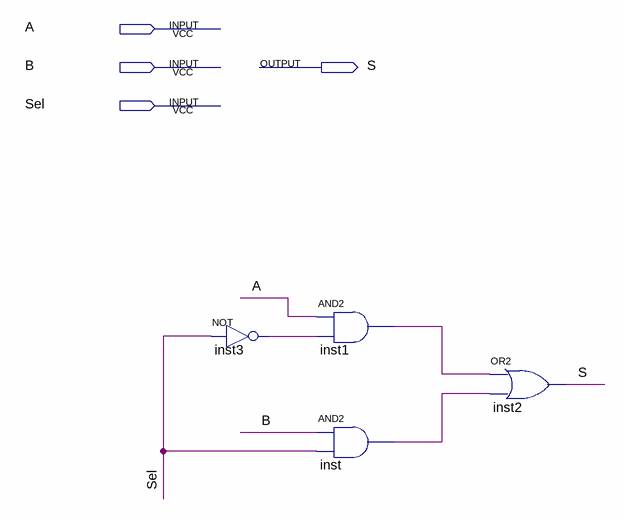
[diagram p0: schematic sheet]
// Quartus schematic MUX21.bdf as structural Verilog: 4 symbols, 4 pins
module MUX21 (
  input  A,
  input  B,
  input  Sel,
  output S
);

  wire inst1_out, inst3_out, inst_out;

  not inst3 (inst3_out, Sel);
  and inst1 (inst1_out, A, inst3_out);
  and inst (inst_out, B, Sel);
  or inst2 (S, inst1_out, inst_out);
endmodule
